# Altium schematic sheet Status LEDs.SchDoc
size B
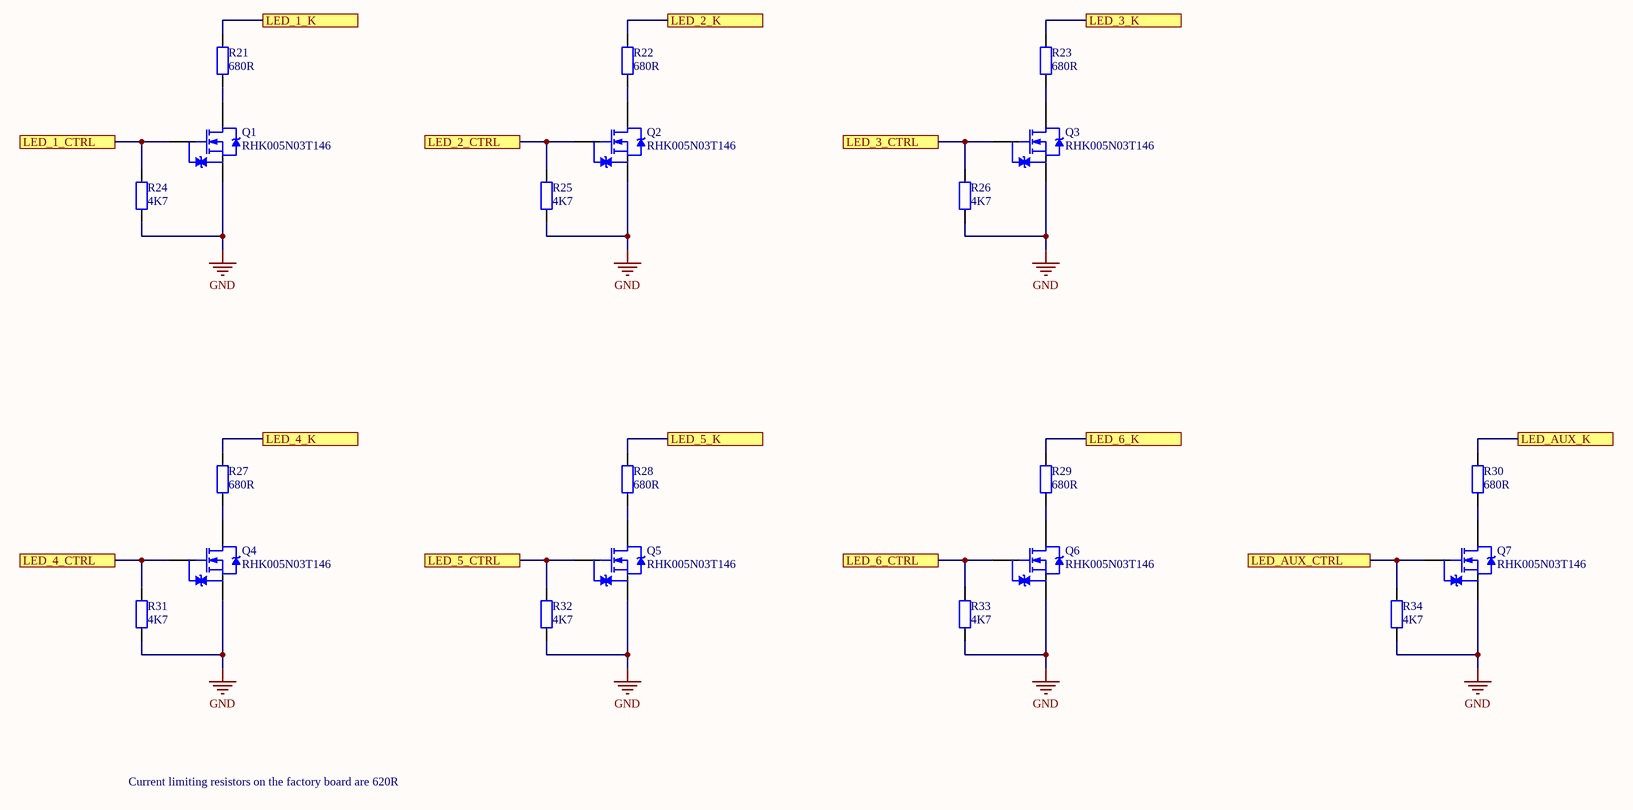
[diagram p0: Status LEDs.SchDoc]

## Parts
Q1  RHK005N03T146  [RHK005N03T146 - SOT95P280X110-3N]
Q2  RHK005N03T146  [RHK005N03T146 - SOT95P280X110-3N]
Q3  RHK005N03T146  [RHK005N03T146 - SOT95P280X110-3N]
Q4  RHK005N03T146  [RHK005N03T146 - SOT95P280X110-3N]
Q5  RHK005N03T146  [RHK005N03T146 - SOT95P280X110-3N]
Q6  RHK005N03T146  [RHK005N03T146 - SOT95P280X110-3N]
Q7  RHK005N03T146  [RHK005N03T146 - SOT95P280X110-3N]
R21  680R  [RES_SM0603_YAGEORC_N]
R22  680R  [RES_SM0603_YAGEORC_N]
R23  680R  [RES_SM0603_YAGEORC_N]
R24  4K7  [RES_SM0603_YAGEORC_N]
R25  4K7  [RES_SM0603_YAGEORC_N]
R26  4K7  [RES_SM0603_YAGEORC_N]
R27  680R  [RES_SM0603_YAGEORC_N]
R28  680R  [RES_SM0603_YAGEORC_N]
R29  680R  [RES_SM0603_YAGEORC_N]
R30  680R  [RES_SM0603_YAGEORC_N]
R31  4K7  [RES_SM0603_YAGEORC_N]
R32  4K7  [RES_SM0603_YAGEORC_N]
R33  4K7  [RES_SM0603_YAGEORC_N]
R34  4K7  [RES_SM0603_YAGEORC_N]

## Ports
LED_1_CTRL, LED_1_K, LED_2_CTRL, LED_2_K, LED_3_CTRL, LED_3_K, LED_4_CTRL, LED_4_K, LED_5_CTRL, LED_5_K, LED_6_CTRL, LED_6_K, LED_AUX_CTRL, LED_AUX_K

## Nets
GND: Q1.1(S) Q2.1(S) Q3.1(S) Q4.1(S) Q5.1(S) Q6.1(S) Q7.1(S) R24.1 R25.1 R26.1 R31.1 R32.1 R33.1 R34.1
LED_1_CTRL: Q1.2(G) R24.2 ; port LED_1_CTRL
LED_1_K: R21.2 ; port LED_1_K
LED_2_CTRL: Q2.2(G) R25.2 ; port LED_2_CTRL
LED_2_K: R22.2 ; port LED_2_K
LED_3_CTRL: Q3.2(G) R26.2 ; port LED_3_CTRL
LED_3_K: R23.2 ; port LED_3_K
LED_4_CTRL: Q4.2(G) R31.2 ; port LED_4_CTRL
LED_4_K: R27.2 ; port LED_4_K
LED_5_CTRL: Q5.2(G) R32.2 ; port LED_5_CTRL
LED_5_K: R28.2 ; port LED_5_K
LED_6_CTRL: Q6.2(G) R33.2 ; port LED_6_CTRL
LED_6_K: R29.2 ; port LED_6_K
LED_AUX_CTRL: Q7.2(G) R34.2 ; port LED_AUX_CTRL
LED_AUX_K: R30.2 ; port LED_AUX_K
NetQ1_3: Q1.3(D) R21.1
NetQ2_3: Q2.3(D) R22.1
NetQ3_3: Q3.3(D) R23.1
NetQ4_3: Q4.3(D) R27.1
NetQ5_3: Q5.3(D) R28.1
NetQ6_3: Q6.3(D) R29.1
NetQ7_3: Q7.3(D) R30.1

## Notes on the sheet
- Current limiting resistors on the factory board are 620R

## Library data of the parts
Q1-Q7 = RHK005N03T146: MOSFET N-CH 30V 500MA
R21-R23 R27-R30 = RC0603FR-07680RL: RES 680R SM0603 YAGEO RC_L; Power (Watts): 0.1; Resistance (Ohms): 680; Tolerance (%): 1; Value: 680R; Category: Resistor; Manufacturer: Yageo; Manufacturer Part Number: RC0603FR-07680RL; Package: 0603; Supplier Part Number 1: 9238468; Supplier 1: Farnell; ComponentLink1URL: http://www.yageo.com; ComponentLink1Description: Manufacturer Website; Supplier 2: Digi-Key; Supplier Part Number 2: 311-680HRCT-ND
R24-R26 R31-R34 = RC0603FR-074K7L: RES 4K7 SM0603 YAGEO RC_L; Power (Watts): 0.1; Resistance (Ohms): 4700; Tolerance (%): 1; Value: 4K7; Category: Resistor; Manufacturer: Yageo; Manufacturer Part Number: RC0603FR-074K7L; Package: 0603; Supplier Part Number 1: 9238565; Supplier 1: Farnell; ComponentLink1URL: http://www.yageo.com; ComponentLink1Description: Manufacturer Website; Supplier 2: Digi-Key; Supplier Part Number 2: 311-4.70KHRCT-ND